# Altium schematic sheet GSM.SchDoc: GSM
size A4; SheetNumber: 6; SheetTotal: 8
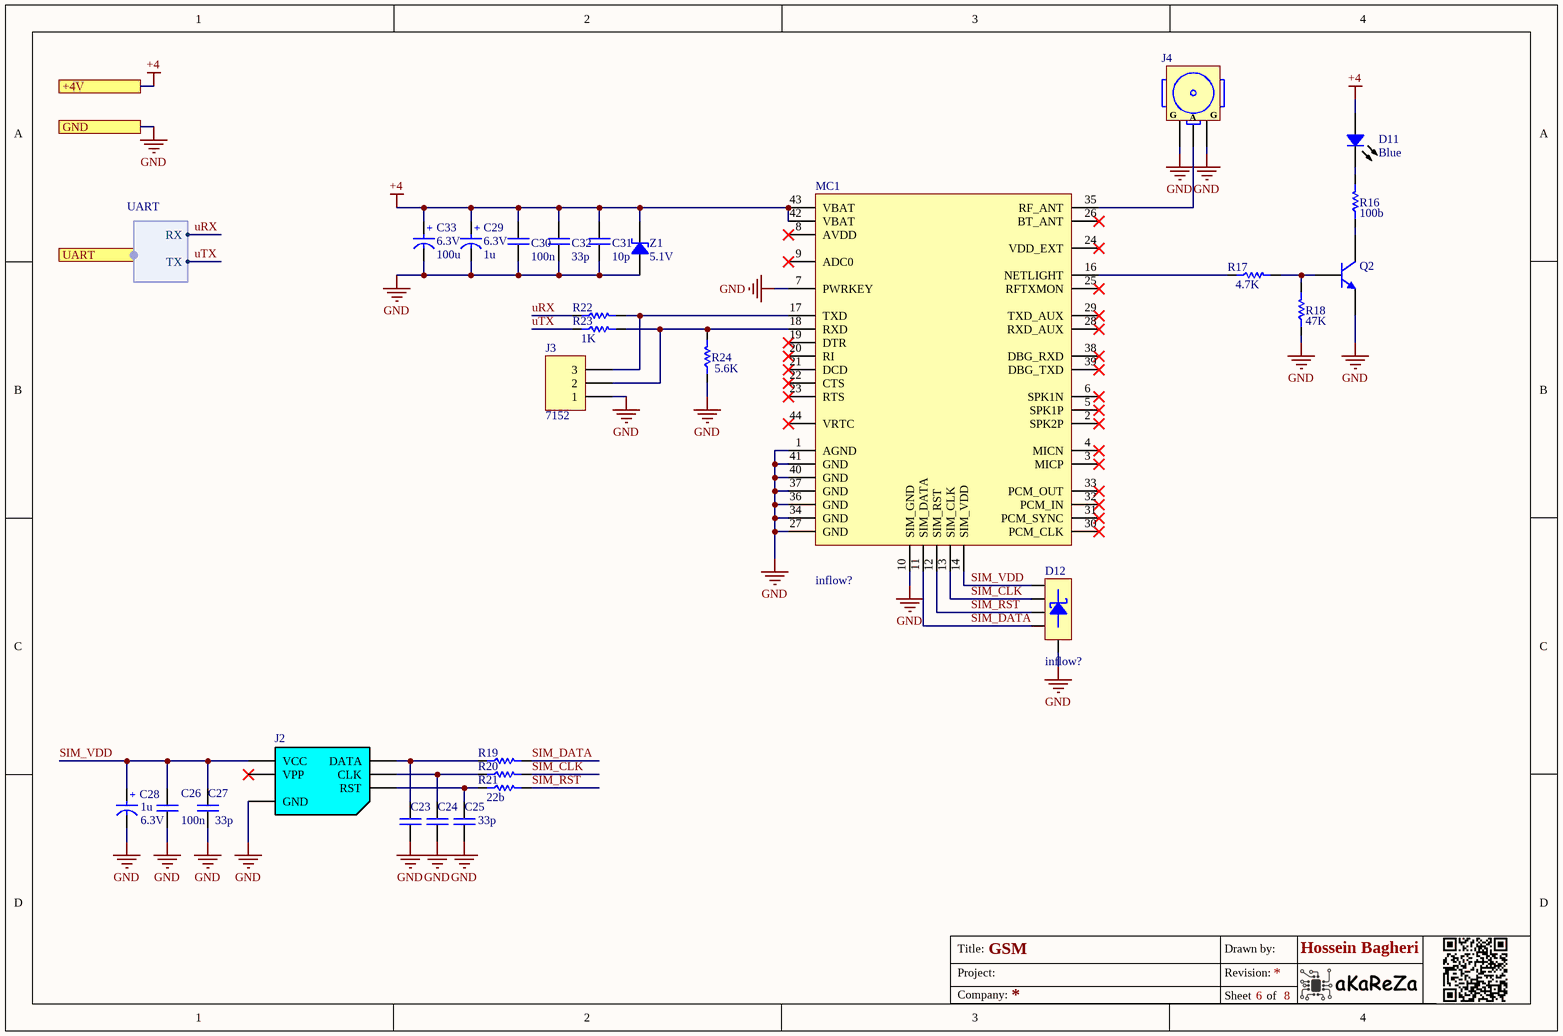
[diagram p0: GSM.SchDoc]

## Parts
C23  33p  [CAP 0805/2012]  (value not drawn)
C24  33p  [CAP 0805/2012]  (value not drawn)
C25  33p  [CAP 0805/2012]
C26  100n  [CAP 0805/2012]
C27  33p  [CAP 0805/2012]
C28  Rating: 6.3V  [SMT_C_Tantalum_A]  (hidden comment: 1u)
C29  Rating: 6.3V  [SMT_C_Tantalum_A]  (hidden comment: 1u)
C30  100n  [CAP 1206/3216]
C31  10p  [CAP 1206/3216]
C32  33p  [CAP 1206/3216]
C33  Rating: 6.3V  [SMT_C_Tantalum_C]  (hidden comment: 100u)
D11  Blue  [LED 0805/2012 BLUE]
D12  Inflow: inflow?  [SC70-5_N]  (hidden comment: SMF-05)
J2  6'Pin  [GCT_SIM8051_Plastik]  (value not drawn)
J3  Inflow: 7152  [HDR_THT_3M_2.54mm]  (hidden comment: 3)
J4  U.FL  [IPEX-3x3mm]  (value not drawn)
MC1  Inflow: inflow?  [m66]  (hidden comment: M66)
Q2  NPN  [SOT23_N]  (value not drawn)
R16  100b  [RES 0805 (2012X06L)]
R17  4.7K  [RES 0805 (2012X06L)]
R18  47K  [RES 0805 (2012X06L)]
R19  22b  [RES 0805 (2012X06L)]  (value not drawn)
R20  22b  [RES 0805 (2012X06L)]  (value not drawn)
R21  22b  [RES 0805 (2012X06L)]
R22  1K  [RES 0805 (2012X06L)]  (value not drawn)
R23  1K  [RES 0805 (2012X06L)]
R24  5.6K  [RES 0805 (2012X06L)]
Z1  5.1V  [SOD80, LL-34]

## Ports
+4V, GND, UART (harness UART)

## Harnesses
UART: RX, TX

## Nets
+4: C29.1(+) C30.1 C31.1 C32.1 C33.1(+) D11.1 MC1.42(VBAT) MC1.43(VBAT) Z1.2 ; port +4V
GND: C23.2 C24.2 C25.2 C26.2 C27.2 C28.2(-) C29.2(-) C30.2 C31.2 C32.2 C33.2(-) D12.2(K) J2.5(GND) J3.1 J4.2(G) J4.3(G) MC1.1(AGND) MC1.7(PWRKEY) MC1.10(SIM_GND) MC1.27(GND) MC1.34(GND) MC1.36(GND) MC1.37(GND) MC1.40(GND) MC1.41(GND) Q2.2(E) R18.1 R24.1 Z1.1 ; port GND
SIM_CLK: D12.3(K) MC1.13(SIM_CLK) R20.2
SIM_DATA: D12.5(K) MC1.11(SIM_DATA) R19.2
SIM_RST: D12.4(K) MC1.12(SIM_RST) R21.2
SIM_VDD: C26.1 C27.1 C28.1(+) D12.1(K) J2.1(VCC) MC1.14(SIM_VDD)
uRX: R22.1 ; port UART.RX
uTX: R23.1 ; port UART.TX
NetC23_1: C23.1 J2.4(DATA) R19.1
NetC24_1: C24.1 J2.3(CLK) R20.1
NetC25_1: C25.1 J2.2(RST) R21.1
NetD11_2: D11.2 R16.2
NetJ3_2: J3.2 MC1.18(RXD) R23.2 R24.2
NetJ3_3: J3.3 MC1.17(TXD) R22.2
NetJ4_1: J4.1(A) MC1.35(RF_ANT)
NetMC1_16: MC1.16(NETLIGHT) R17.1
NetQ2_1: Q2.1(B) R17.2 R18.2
NetQ2_3: Q2.3(C) R16.1

Not connected (* = marked no-connect by the designer): J2 6(VPP)*; MC1 2(SPK2P)* 3(MICP)* 4(MICN)* 5(SPK1P)* 6(SPK1N)* 8(AVDD)* 9(ADC0)* 19(DTR)* 20(RI)* 21(DCD)* 22(CTS)* 23(RTS)* 24(VDD_EXT)* 25(RFTXMON)* 26(BT_ANT)* 28(RXD_AUX)* 29(TXD_AUX)* 30(PCM_CLK)* 31(PCM_SYNC)* 32(PCM_IN)* 33(PCM_OUT)* 38(DBG_RXD)* 39(DBG_TXD)* 44(VRTC)*

## Notes on the sheet
- Title:
- Project:
- Drawn by:
- Revision:
- Hossein Bagheri
- Company:
- Sheet
- of

## Library data of the parts
C23-C25 C27 = Cap_Multi_SMD_0805: Bipolar ceramic capacitor SMD; Inflow: inflow?; Type: MultiLayer; Rating: Rating?; Package: 0805; Value: 33p
C26 = Cap_Multi_SMD_100nF_0805: Bipolar ceramic capacitor SMD; Inflow: inflow?; Type: MultiLayer; Rating: 50V; Package: 0805; Value: 100n
C28 C29 C33 = Cap_Tantalum: Tantalum Capacitor,TAJ Series-SMD; Inflow: inflow?; Type: Tantalum
  C28 C29: Package: SMD-A; Value: 1u
  C33: Package: SMD-C; Value: 100u
C30 = Cap_Multi_SMD_100nF_1206: Bipolar ceramic capacitor SMD; Type: MultiLayer; Inflow: inflow?; Rating: 50V; Package: 1206; Value: 100n
C31 C32 = Cap_Multi_SMD_1206: Bipolar ceramic capacitor SMD; Inflow: inflow?; Type: MultiLayer; Rating: 50V; Package: 1206
  C31: Value: 10p
  C32: Value: 33p
D11 = Semi_LED_SMD: LED; Inflow: inflow?; Rating: Rating?; Validation: Valid; Package: Package?; Type: LED; Value: Blue
D12 = Semi_Diod_TVS_SMF05: TVS Diode Array; Rating: Rating?; Validation: Valid; Type: TVS; Value: SMF-05; Package: SC70-5
J2 = Con_Socket_SimCard_1: Nano SimCard Holder 6P; Rating: Rating?; Validation: Valid; Inflow: inflow?; Package: SMD; Type: Nano; Value: 6'Pin
J3 = Con_MPH_3x1_V_THT_2.54: Header, single row, 3 pin; Rating: Rating?; Validation: NT; Value: 3; Package: Package?; Type: Type?
J4 = Con_RF_U.FL: Rating: Rating?; Inflow: inflow?; Type: RF; Package: SMD; Value: U.FL
MC1 = ModSen_Com_M66: Quectel GSM/GPRS Module; Rating: Rating?; Validation: Valid; Package: Dip; Value: M66; Type: GSM-GPRS
Q2 = Semi_BJT_BC817: NPN General purpose Transistor; Rating: Rating?; Type: Type?; Validation: Valid; Inflow: inflow?; Value: NPN; Package: Package?
R16-R24 = Res_SMD_0805: Resistor; Inflow: inflow?; Rating: 0.125W; Package: 0805; Type: 10%
  R16: Value: 100b
  R17: Value: 4.7K
  R18: Value: 47K
  R19-R21: Value: 22b
  R22 R23: Value: 1K
  R24: Value: 5.6K
Z1 = Semi_Diod_Zener_SMD: Zener Diode; Rating: 0.5W; Inflow: inflow?; Type: Zener; Value: 5.1V; Package: SOD-80